# EAGLE schematic picrocope_hub_v3r1 (EAGLE 9.6.2)

## Sheet 1 of 3: Connectors
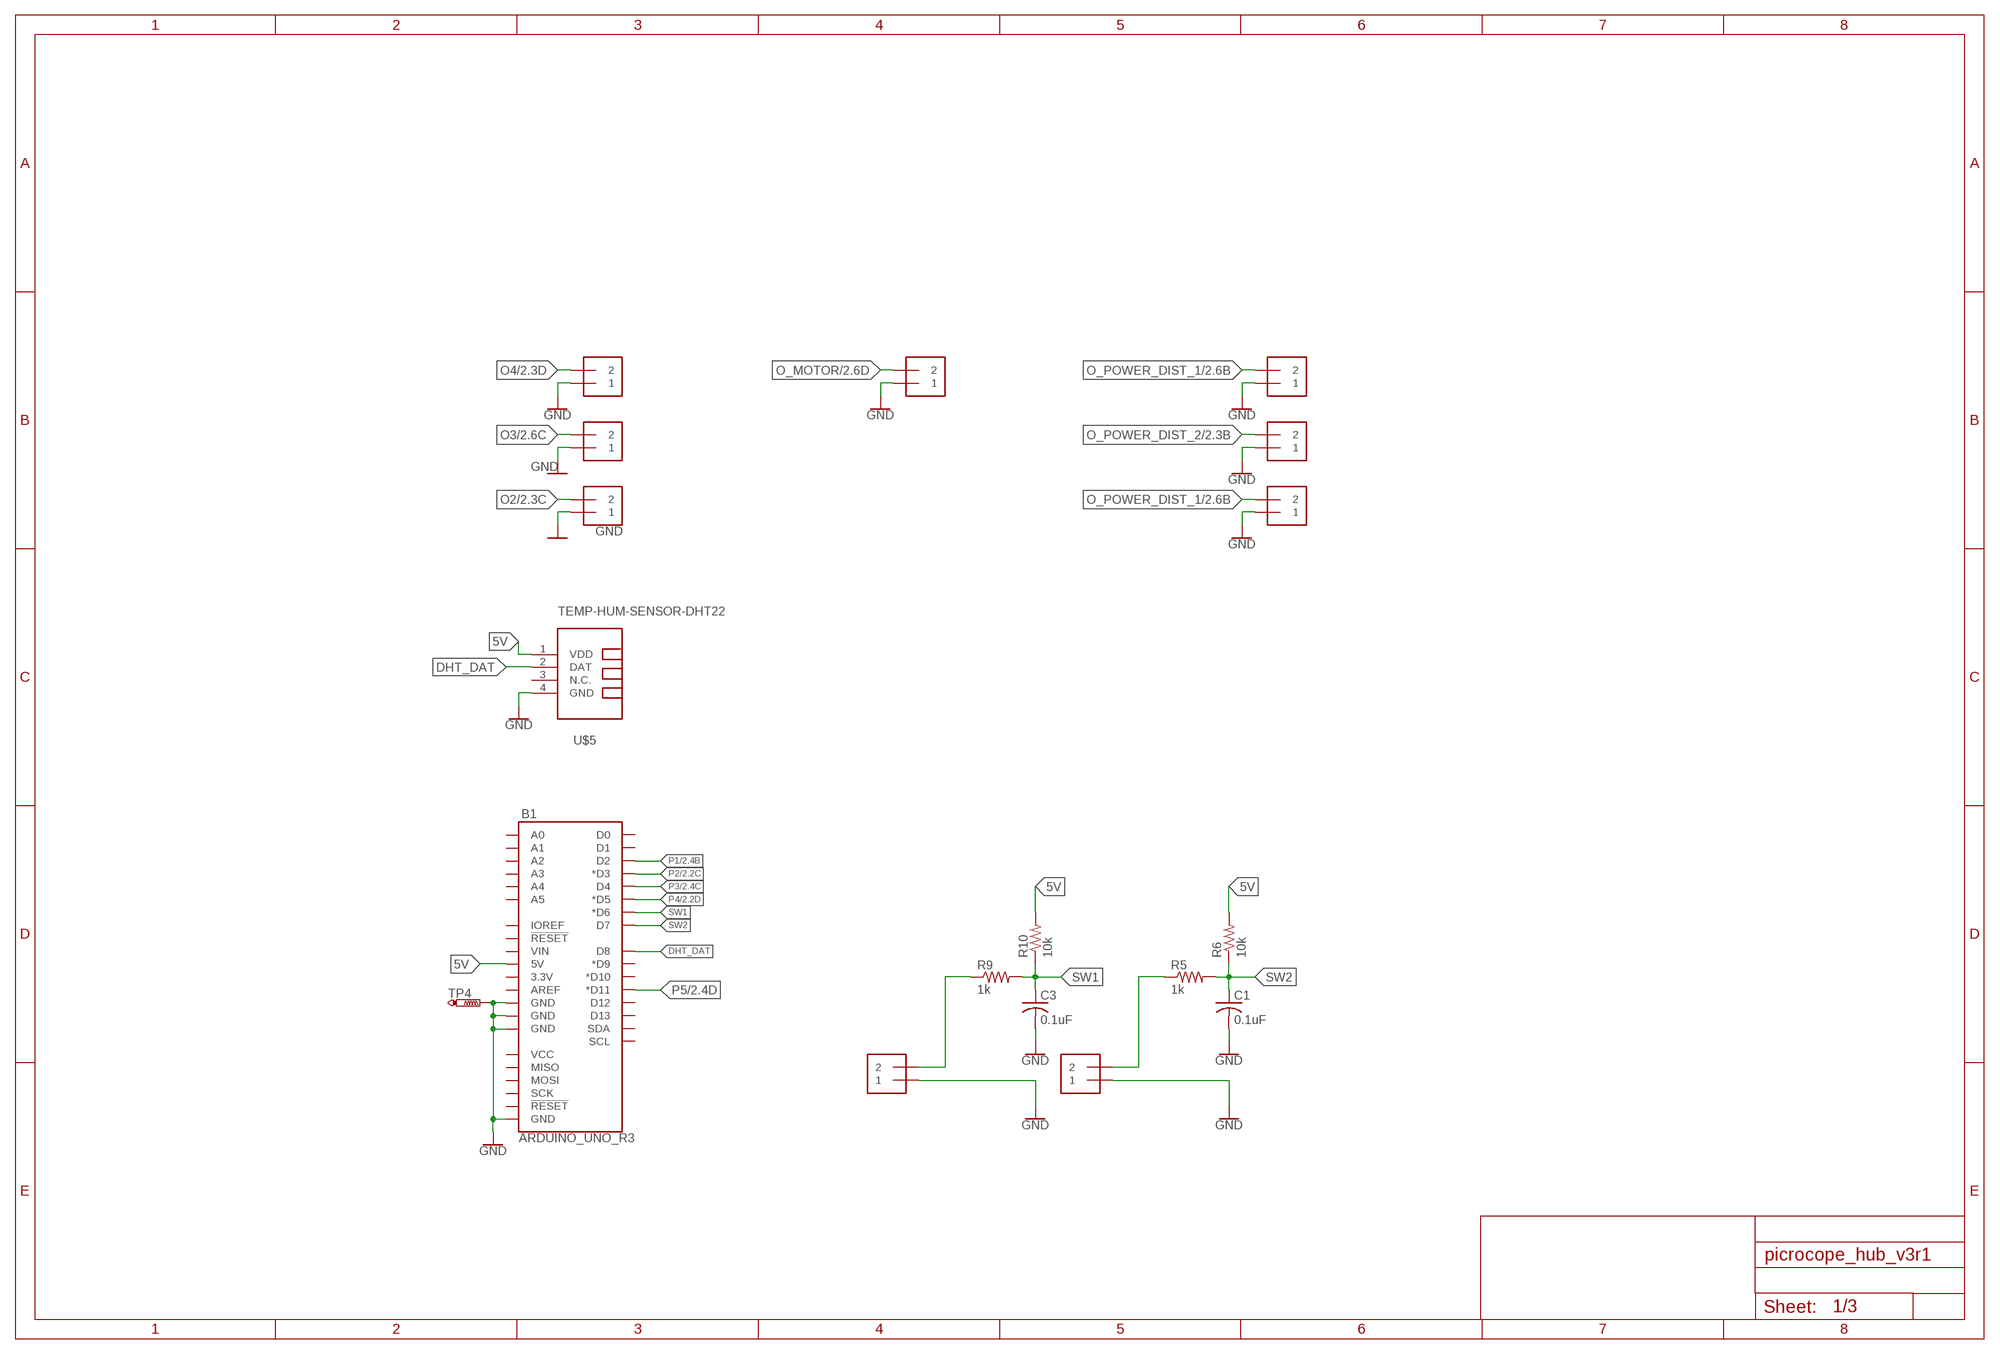
[diagram p0: schematic, sheet 1]

### Parts
B1  ARDUINO_UNO_R3  [ARDUINO_R3]
C1  0.1uF  C-USC0603  [C0603]
C3  0.1uF  C-USC0603  [C0603]
R5  1k  R-US_R0603  [R0603]
R6  10k  R-US_R0603  [R0603]
R9  1k  R-US_R0603  [R0603]
R10  10k  R-US_R0603  [R0603]
TP4  PTR1B1,27  [B1,27]
U$5  TEMP-HUM-SENSOR-DHT22  [TEMP-HUM-SENSOR-DHT22]
U$6  MOLEX_0039301022  [MINI-FIT_JR_CONN]
U$7  MOLEX_0039301022  [MINI-FIT_JR_CONN]
U$8  MOLEX_0039301022  [MINI-FIT_JR_CONN]
U$9  MOLEX_0039301022  [MINI-FIT_JR_CONN]
U$12  MOLEX_0039301022  [MINI-FIT_JR_CONN]
U$13  MOLEX_0039301022  [MINI-FIT_JR_CONN]
U$14  MOLEX_0039301022  [MINI-FIT_JR_CONN]
U$15  MOLEX_0039301022  [MINI-FIT_JR_CONN]
U$18  MOLEX_0039301022  [MINI-FIT_JR_CONN]

### Nets
5V: B1.5V R6.2 R10.2 U$5.1(VDD)
DHT_DAT: B1.D8 U$5.2(DAT)
GND: B1.GND@1(GND) B1.GND@2(GND) B1.GND@3(GND) B1.GND@4(GND) C1.2 C3.2 TP4.TP U$5.4(GND) U$6.P$2 U$7.P$2 U$8.P$2 U$9.P$2 U$12.P$2 U$13.P$2 U$14.P$2 U$15.P$2 U$18.P$2 ; also sheet 2,3
N$4: R5.1 U$18.P$1
N$12: R9.1 U$15.P$1
O2: U$7.P$1 ; also sheet 2
O3: U$8.P$1 ; also sheet 2
O4: U$9.P$1 ; also sheet 2
O_MOTOR: U$14.P$1 ; also sheet 2
O_POWER_DIST_1: U$6.P$1 U$13.P$1 ; also sheet 2
O_POWER_DIST_2: U$12.P$1 ; also sheet 2
P1: B1.D2 ; also sheet 2
P2: B1.D3(*D3) ; also sheet 2
P3: B1.D4 ; also sheet 2
P4: B1.D5(*D5) ; also sheet 2
P5: B1.D11(*D11) ; also sheet 2
SW1: B1.D6(*D6) C3.1 R9.2 R10.1
SW2: B1.D7 C1.1 R5.2 R6.1
Unconnected: B1.3.3V B1.A0 B1.A1 B1.A2 B1.A3 B1.A4 B1.A5 B1.AREF B1.D0 B1.D1 B1.D9(*D9) B1.D10(*D10) B1.D12 B1.D13 B1.IOREF B1.MISO B1.MOSI B1.RESET@1(!RESET!) B1.RESET@2(!RESET!) B1.SCK B1.SCL B1.SDA B1.VCC B1.VIN U$5.3(N.C.)

## Sheet 2 of 3: Relays
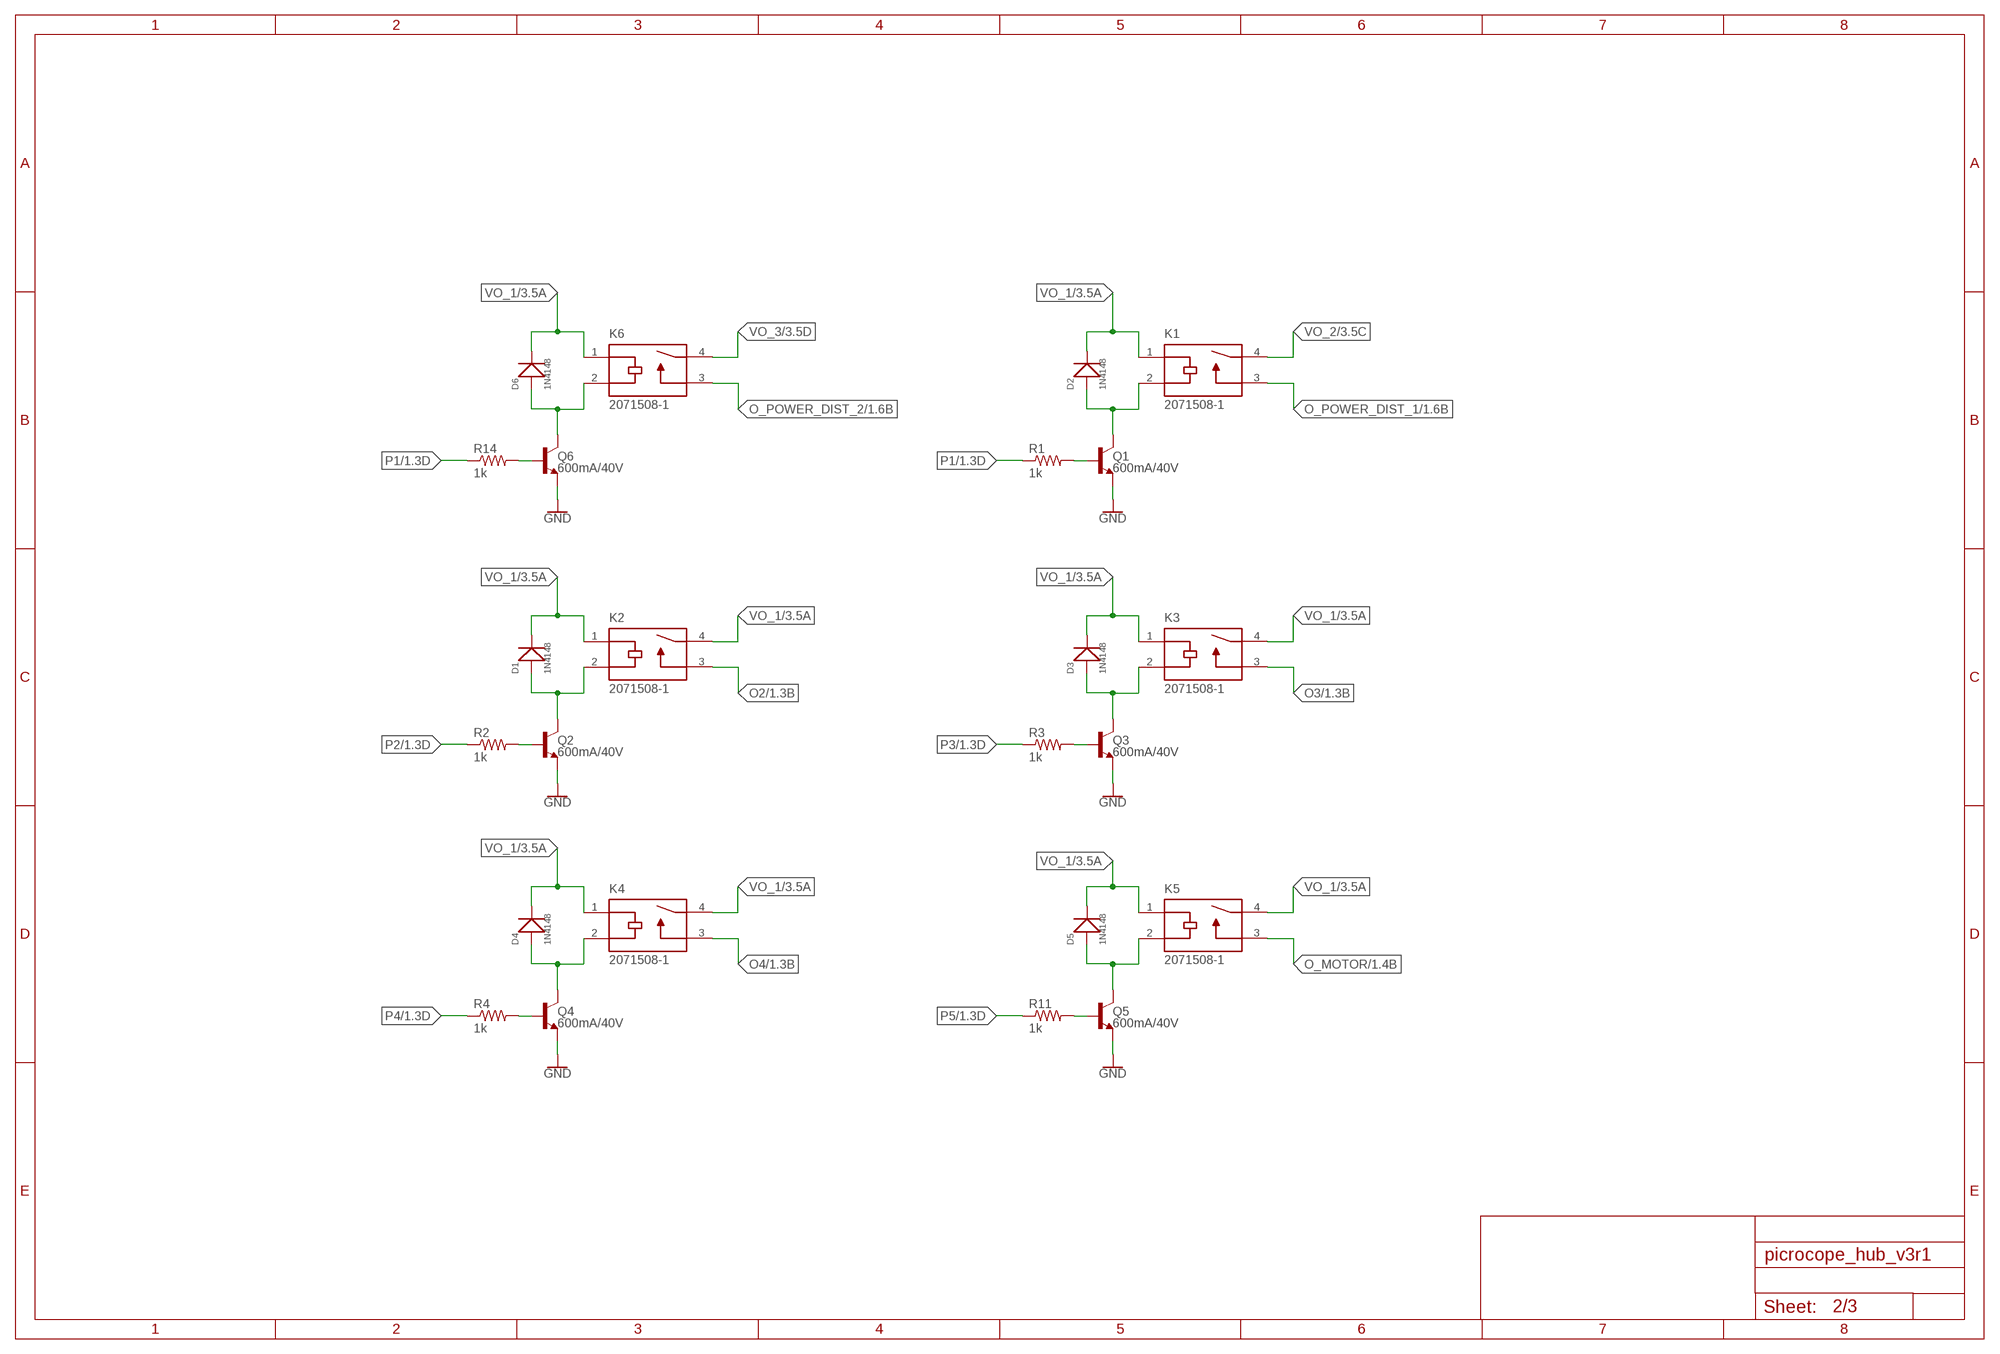
[diagram p1: schematic, sheet 2]

### Parts
D1  1N4148  SMD-DIODE-SWITCH-1N4148(LL-34)  [LL-34]
D2  1N4148  SMD-DIODE-SWITCH-1N4148(LL-34)  [LL-34]
D3  1N4148  SMD-DIODE-SWITCH-1N4148(LL-34)  [LL-34]
D4  1N4148  SMD-DIODE-SWITCH-1N4148(LL-34)  [LL-34]
D5  1N4148  SMD-DIODE-SWITCH-1N4148(LL-34)  [LL-34]
D6  1N4148  SMD-DIODE-SWITCH-1N4148(LL-34)  [LL-34]
K1  2071508-1  [RELAY_2071508-1]
K2  2071508-1  [RELAY_2071508-1]
K3  2071508-1  [RELAY_2071508-1]
K4  2071508-1  [RELAY_2071508-1]
K5  2071508-1  [RELAY_2071508-1]
K6  2071508-1  [RELAY_2071508-1]
Q1  600mA/40V  TRANS_NPN-MMBT2222AL  [SOT23-3]
Q2  600mA/40V  TRANS_NPN-MMBT2222AL  [SOT23-3]
Q3  600mA/40V  TRANS_NPN-MMBT2222AL  [SOT23-3]
Q4  600mA/40V  TRANS_NPN-MMBT2222AL  [SOT23-3]
Q5  600mA/40V  TRANS_NPN-MMBT2222AL  [SOT23-3]
Q6  600mA/40V  TRANS_NPN-MMBT2222AL  [SOT23-3]
R1  1k  R-US_R0603  [R0603]
R2  1k  R-US_R0603  [R0603]
R3  1k  R-US_R0603  [R0603]
R4  1k  R-US_R0603  [R0603]
R11  1k  R-US_R0603  [R0603]
R14  1k  R-US_R0603  [R0603]

### Nets
GND: Q1.2(E) Q2.2(E) Q3.2(E) Q4.2(E) Q5.2(E) Q6.2(E) ; also sheet 1,3
N$1: Q1.1(B) R1.2
N$2: D2.A(+) K1.2(COIL2) Q1.3(C)
N$5: Q2.1(B) R2.2
N$6: D1.A(+) K2.2(COIL2) Q2.3(C)
N$7: Q3.1(B) R3.2
N$8: D3.A(+) K3.2(COIL2) Q3.3(C)
N$9: Q4.1(B) R4.2
N$10: D4.A(+) K4.2(COIL2) Q4.3(C)
N$14: Q5.1(B) R11.2
N$17: D5.A(+) K5.2(COIL2) Q5.3(C)
N$18: Q6.1(B) R14.2
N$21: D6.A(+) K6.2(COIL2) Q6.3(C)
O2: K2.3(NO) ; also sheet 1
O3: K3.3(NO) ; also sheet 1
O4: K4.3(NO) ; also sheet 1
O_MOTOR: K5.3(NO) ; also sheet 1
O_POWER_DIST_1: K1.3(NO) ; also sheet 1
O_POWER_DIST_2: K6.3(NO) ; also sheet 1
P1: R1.1 R14.1 ; also sheet 1
P2: R2.1 ; also sheet 1
P3: R3.1 ; also sheet 1
P4: R4.1 ; also sheet 1
P5: R11.1 ; also sheet 1
VO_1: D1.C(-) D2.C(-) D3.C(-) D4.C(-) D5.C(-) D6.C(-) K1.1(COIL1) K2.1(COIL1) K2.4(COM) K3.1(COIL1) K3.4(COM) K4.1(COIL1) K4.4(COM) K5.1(COIL1) K5.4(COM) K6.1(COIL1) ; also sheet 3
VO_2: K1.4(COM) ; also sheet 3
VO_3: K6.4(COM) ; also sheet 3

## Sheet 3 of 3: Power regulators
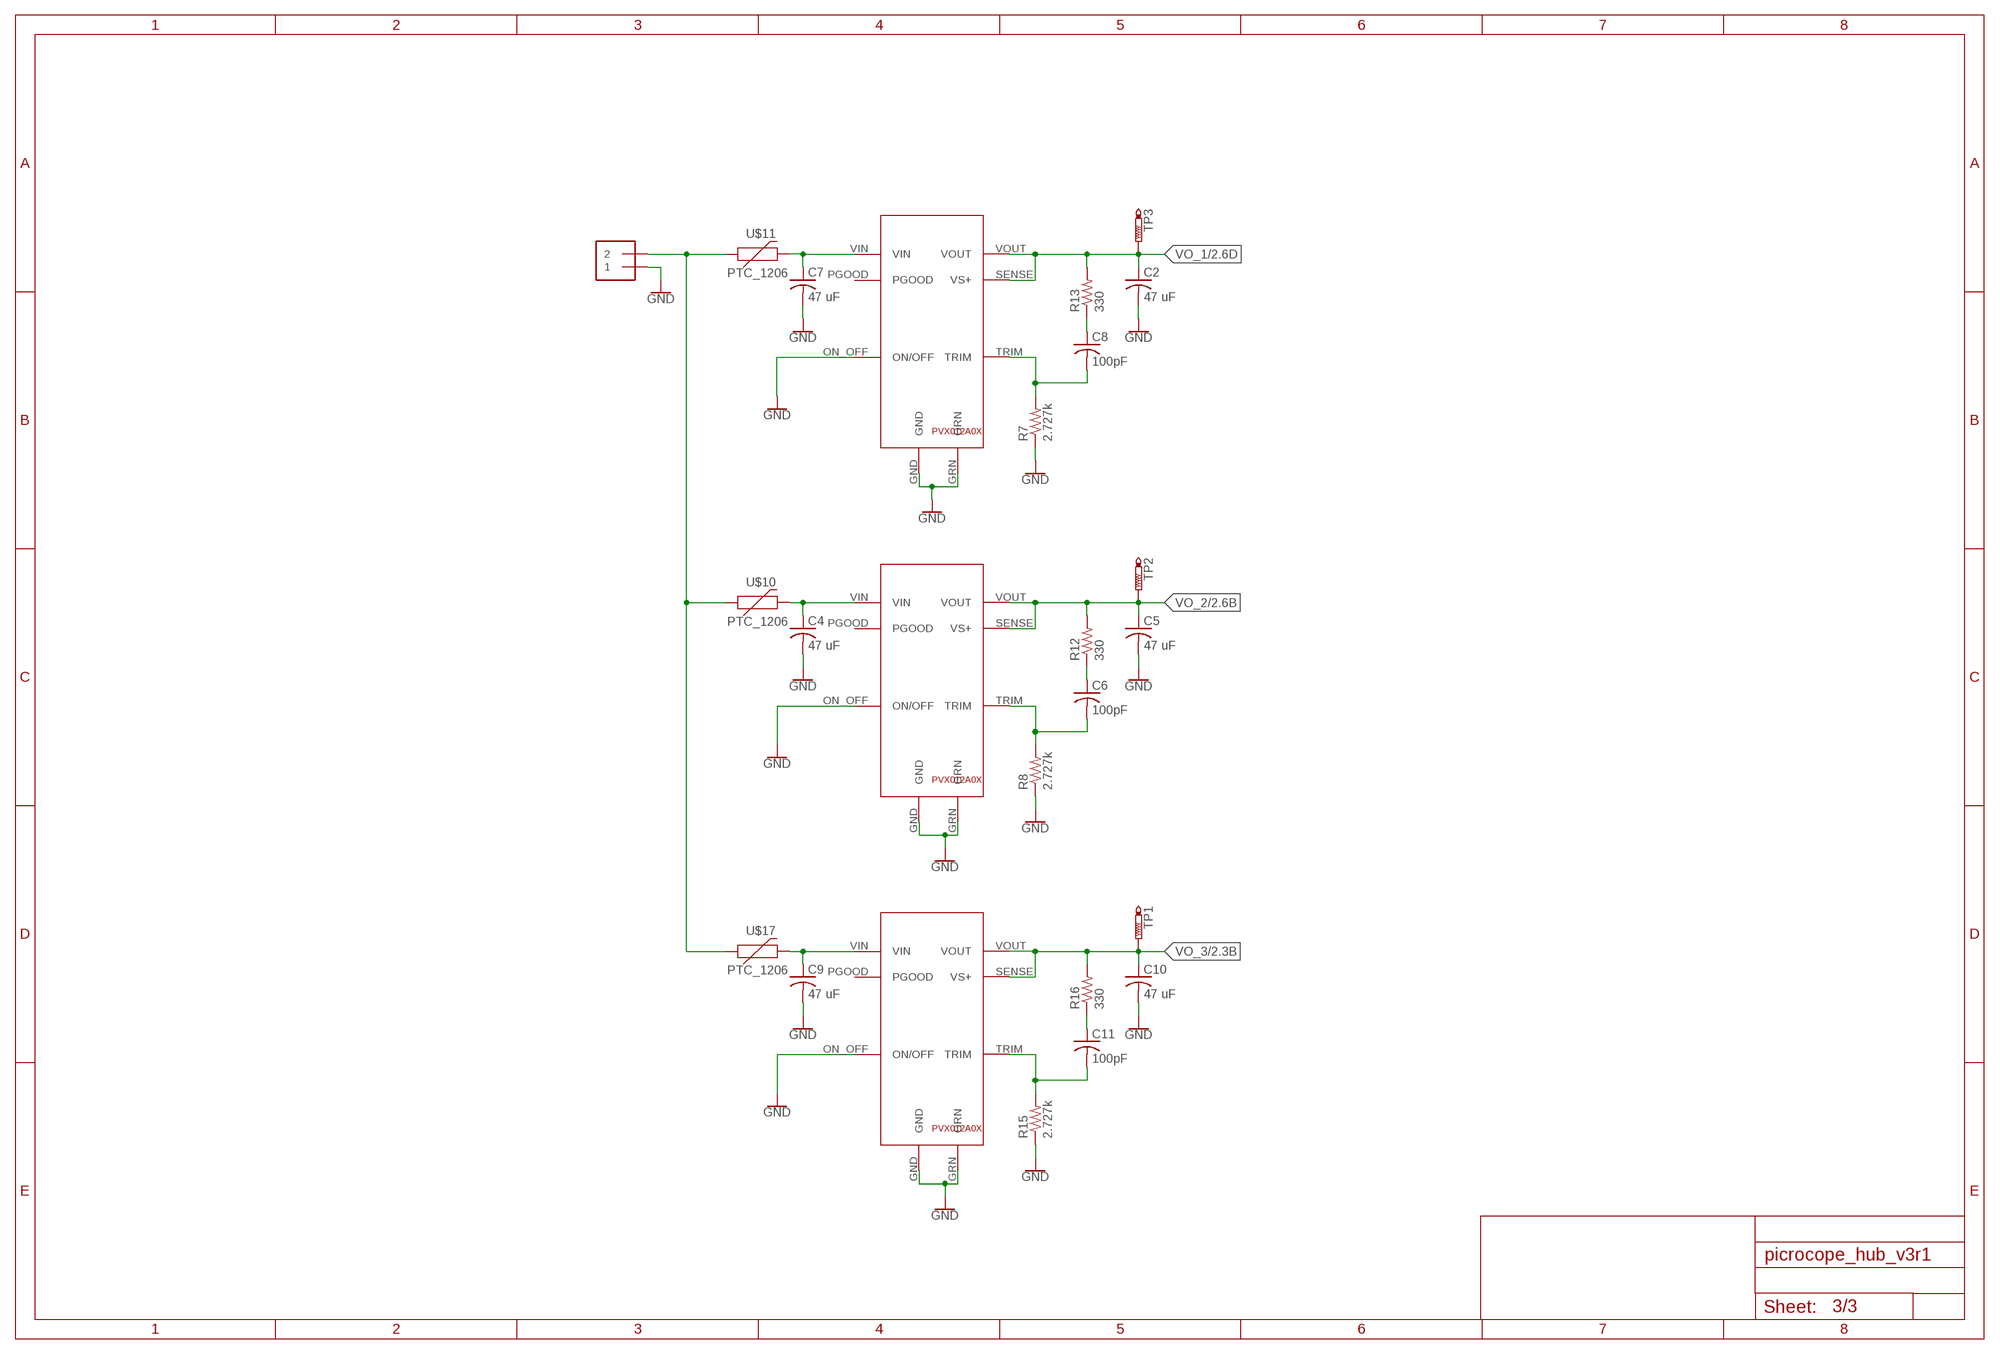
[diagram p2: schematic, sheet 3]

### Parts
C2  47 uF  C-USC1210  [C1210]
C4  47 uF  C-USC1210  [C1210]
C5  47 uF  C-USC1210  [C1210]
C6  100pF  C-USC0603  [C0603]
C7  47 uF  C-USC1210  [C1210]
C8  100pF  C-USC0603  [C0603]
C9  47 uF  C-USC1210  [C1210]
C10  47 uF  C-USC1210  [C1210]
C11  100pF  C-USC0603  [C0603]
R7  2.727k  R-US_R0603  [R0603]
R8  2.727k  R-US_R0603  [R0603]
R12  330  R-US_R0603  [R0603]
R13  330  R-US_R0603  [R0603]
R15  2.727k  R-US_R0603  [R0603]
R16  330  R-US_R0603  [R0603]
TP1  PTR1B1,27  [B1,27]
TP2  PTR1B1,27  [B1,27]
TP3  PTR1B1,27  [B1,27]
U$1  PVX012A0XV1  [PVX012A0X]
U$2  PVX012A0XV1  [PVX012A0X]
U$3  MOLEX_0039301022  [MINI-FIT_JR_CONN]
U$4  PVX012A0XV1  [PVX012A0X]
U$10  PTC_1206  [1206]
U$11  PTC_1206  [1206]
U$17  PTC_1206  [1206]

### Nets
GND: C2.2 C4.2 C5.2 C7.2 C9.2 C10.2 R7.1 R8.1 R15.1 U$1.GND U$1.GRN U$1.ON_OFF(ON/OFF) U$2.GND U$2.GRN U$2.ON_OFF(ON/OFF) U$3.P$2 U$4.GND U$4.GRN U$4.ON_OFF(ON/OFF) ; also sheet 1,2
N$3: U$3.P$1 U$10.1 U$11.1 U$17.1
N$15: C6.1 R12.1
N$16: C8.1 R13.1
N$19: C6.2 R8.2 U$2.TRIM
N$20: C8.2 R7.2 U$1.TRIM
N$23: C11.2 R15.2 U$4.TRIM
N$25: C11.1 R16.1
VIN_1: C7.1 U$1.VIN U$11.2
VIN_2: C4.1 U$2.VIN U$10.2
VIN_3: C9.1 U$4.VIN U$17.2
VO_1: C2.1 R13.2 TP3.TP U$1.SENSE(VS+) U$1.VOUT ; also sheet 2
VO_2: C5.1 R12.2 TP2.TP U$2.SENSE(VS+) U$2.VOUT ; also sheet 2
VO_3: C10.1 R16.2 TP1.TP U$4.SENSE(VS+) U$4.VOUT ; also sheet 2
Unconnected: U$1.PGOOD U$2.PGOOD U$4.PGOOD

## Library data of the parts
B1 = SparkFun-Boards:ARDUINO_UNO_R3: Arduino R3 Footprint with SPI header Arduino Uno R3 Compatible Footprint. Matches PCB size of the original board. SparkFun Products: SAMD21 Dev Breakout <https://www.sparkfun.com/products/13672> RedBoard <https://www.sparkfun.com/products/12757> R3 Stackable Headers <https://www.sparkfun.com/products/11417>
C1-C11 = adafruit:C-US: CAPACITOR, American symbol
D1-D6 = Seeed-Diode:SMD-DIODE-SWITCH-1N4148(LL-34): 304040016; MPN: 1N4148
K1-K6 = 2071508-1:2071508-1: Power Relay 5VDC 10A SPST-NO(18.2mm 10.2mm 15.2mm) THT; MANUFACTURER: TE Connectivity; MAXIMUM_PACKAGE_HEIGHT: 15.7mm; PARTREV: 0919; STANDARD: Manufacturer Recommendations
Q1-Q6 = SparkFun-DiscreteSemi:TRANS_NPN: NPN transistor Current controlled devices typically used to amplify current or used as a switch. BC547 - COM-08928 <http://www.sparkfun.com/products/8928> (TO-92 45V 100mA) (1.Collector 2.Base 3.Emitter) 2N3904 - COM-00521 <http://www.sparkfun.com/products/521> (TO-92 40V 200mA) (1.Emitter 2.Base 3.Collector) P2N2222A - COM-12852 <http://www.sparkfun.com/products/12852> (TO-92 40V 600mA) (1.Collector 2.Base 3.Emitter); PROD_ID: TRANS-08049
R1-R6 R9-R11 R14 = resistor:R-US_: RESISTOR, American symbol
R7 R8 R12 R13 R15 R16 = adafruit:R-US_: RESISTOR, American symbol
TP1-TP4 = testpad:PTR1: TEST PIN
U$1 U$2 U$4 = PVX012A0X:PVX012A0X
U$3 U$6-U$9 U$12-U$15 U$18 = pat:MOLEX_0039301022
U$5 = diy-modules:TEMP-HUM-SENSOR-DHT22: DHT22 - digital humidity & temperature sensor Also known as: AM2302 AM2302 datasheet available here: http://akizukidenshi.com/download/ds/aosong/AM2302.pdf Click here to find device on ebay.com <http://www.ebay.com/sch/dht22+digital+sensor>
U$10 U$11 U$17 = pat:PTC_1206